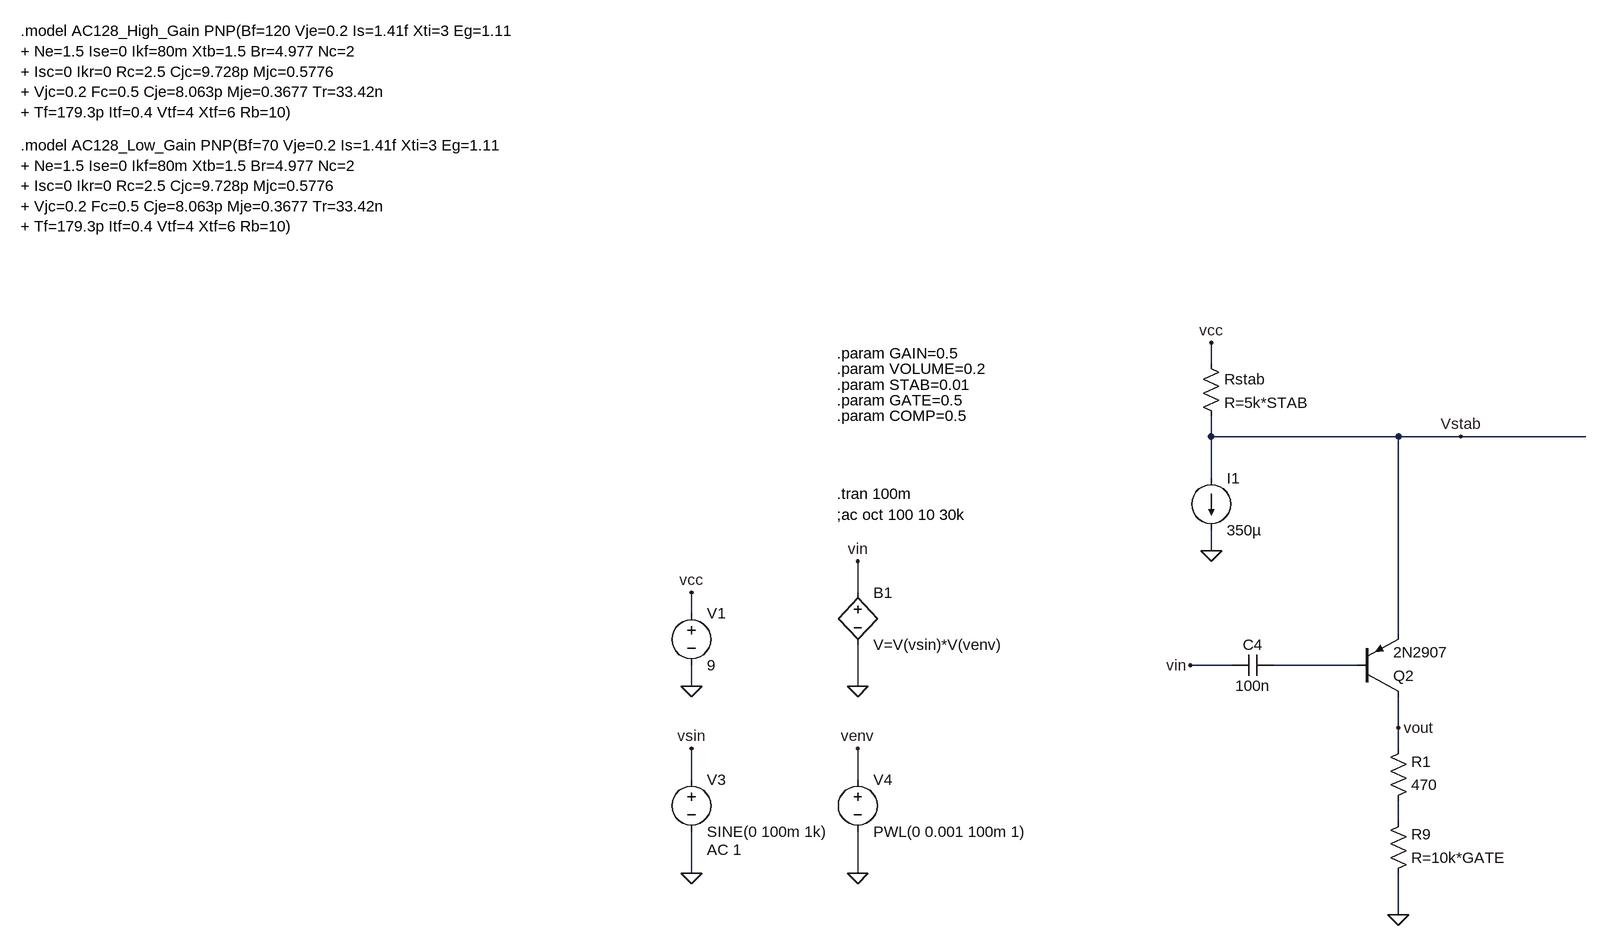
[diagram p0: schematic fuzz_factory_base_04.asc]
fuzz_factory_base_04.asc, the LTspice schematic file:
Version 4
SHEET 1 1968 1668
WIRE 32 -272 32 -304
WIRE 32 -160 32 -192
WIRE 320 -160 32 -160
WIRE 416 -160 320 -160
WIRE 608 -160 416 -160
WIRE 32 -96 32 -160
WIRE 32 16 32 -16
WIRE -512 80 -512 32
WIRE -768 112 -768 80
WIRE 320 144 320 -160
WIRE 64 192 0 192
WIRE 256 192 128 192
WIRE -768 224 -768 192
WIRE -512 224 -512 160
WIRE 320 288 320 240
WIRE 320 320 320 288
WIRE -768 368 -768 320
WIRE -512 368 -512 320
WIRE 320 432 320 400
WIRE -768 512 -768 448
WIRE -512 512 -512 448
WIRE 320 576 320 512
FLAG -768 80 vcc
FLAG -768 224 0
FLAG -512 224 0
FLAG -768 512 0
FLAG -512 512 0
FLAG -768 320 vsin
FLAG -512 320 venv
FLAG 32 -304 vcc
FLAG 320 576 0
FLAG -512 32 vin
FLAG 416 -160 Vstab
FLAG 0 192 vin
FLAG 320 288 vout
FLAG 32 16 0
SYMBOL voltage -768 96 R0
WINDOW 123 0 0 Left 2
WINDOW 39 0 0 Left 2
SYMATTR InstName V1
SYMATTR Value 9
SYMBOL voltage -768 352 R0
WINDOW 123 24 124 Left 2
WINDOW 39 0 0 Left 2
SYMATTR Value2 AC 1
SYMATTR InstName V3
SYMATTR Value SINE(0 100m 1k)
SYMBOL voltage -512 352 R0
WINDOW 123 0 0 Left 2
WINDOW 39 0 0 Left 2
SYMATTR InstName V4
SYMATTR Value PWL(0 0.001 100m 1)
SYMBOL bv -512 64 R0
SYMATTR InstName B1
SYMATTR Value V=V(vsin)*V(venv)
SYMBOL pnp 256 240 M180
SYMATTR InstName Q2
SYMATTR Value 2N2907
SYMBOL res 304 416 M180
WINDOW 0 36 76 Left 2
WINDOW 3 36 40 Left 2
SYMATTR InstName R1
SYMATTR Value 470
SYMBOL cap 128 176 R90
WINDOW 0 0 32 VBottom 2
WINDOW 3 32 32 VTop 2
SYMATTR InstName C4
SYMATTR Value 100n
SYMBOL res 304 528 M180
WINDOW 0 36 76 Left 2
WINDOW 3 36 40 Left 2
SYMATTR InstName R9
SYMATTR Value R=10k*GATE
SYMBOL res 16 -288 R0
SYMATTR InstName Rstab
SYMATTR Value R=5k*STAB
SYMBOL current 32 -96 R0
WINDOW 123 0 0 Left 0
WINDOW 39 0 0 Left 0
SYMATTR InstName I1
SYMATTR Value 350µ
TEXT -544 -288 Left 2 !.param GAIN=0.5
TEXT -544 -264 Left 2 !.param VOLUME=0.2
TEXT -544 -240 Left 2 !.param STAB=0.01
TEXT -544 -72 Left 2 !.tran 100m
TEXT -544 -40 Left 2 !;ac oct 100 10 30k
TEXT -1800 -608 Left 2 !.model AC128_Low_Gain PNP(Bf=70 Vje=0.2 Is=1.41f Xti=3 Eg=1.11\n+ Ne=1.5 Ise=0 Ikf=80m Xtb=1.5 Br=4.977 Nc=2\n+ Isc=0 Ikr=0 Rc=2.5 Cjc=9.728p Mjc=0.5776\n+ Vjc=0.2 Fc=0.5 Cje=8.063p Mje=0.3677 Tr=33.42n\n+ Tf=179.3p Itf=0.4 Vtf=4 Xtf=6 Rb=10)
TEXT -1800 -784 Left 2 !.model AC128_High_Gain PNP(Bf=120 Vje=0.2 Is=1.41f Xti=3 Eg=1.11\n+ Ne=1.5 Ise=0 Ikf=80m Xtb=1.5 Br=4.977 Nc=2\n+ Isc=0 Ikr=0 Rc=2.5 Cjc=9.728p Mjc=0.5776\n+ Vjc=0.2 Fc=0.5 Cje=8.063p Mje=0.3677 Tr=33.42n\n+ Tf=179.3p Itf=0.4 Vtf=4 Xtf=6 Rb=10)
TEXT -544 -216 Left 2 !.param GATE=0.5
TEXT -544 -192 Left 2 !.param COMP=0.5

The netlist it stands for:
* fuzz_factory_base_04.asc
V1 vcc 0 9
V3 vsin 0 SINE(0 100m 1k) AC 1
V4 venv 0 PWL(0 0.001 100m 1)
B1 vin 0 V=V(vsin)*V(venv)
Q2 vout N001 Vstab 0 2N2907
R1 N002 vout 470
C4 N001 vin 100n
R9 0 N002 R=10k*GATE
Rstab vcc Vstab R=5k*STAB
I1 Vstab 0 350µ
.model NPN NPN
.model PNP PNP
.lib standard.bjt
.param GAIN=0.5
.param VOLUME=0.2
.param STAB=0.01
.tran 100m
;ac oct 100 10 30k
.model AC128_Low_Gain PNP(Bf=70 Vje=0.2 Is=1.41f Xti=3 Eg=1.11
+ Ne=1.5 Ise=0 Ikf=80m Xtb=1.5 Br=4.977 Nc=2
+ Isc=0 Ikr=0 Rc=2.5 Cjc=9.728p Mjc=0.5776
+ Vjc=0.2 Fc=0.5 Cje=8.063p Mje=0.3677 Tr=33.42n
+ Tf=179.3p Itf=0.4 Vtf=4 Xtf=6 Rb=10)
.model AC128_High_Gain PNP(Bf=120 Vje=0.2 Is=1.41f Xti=3 Eg=1.11
+ Ne=1.5 Ise=0 Ikf=80m Xtb=1.5 Br=4.977 Nc=2
+ Isc=0 Ikr=0 Rc=2.5 Cjc=9.728p Mjc=0.5776
+ Vjc=0.2 Fc=0.5 Cje=8.063p Mje=0.3677 Tr=33.42n
+ Tf=179.3p Itf=0.4 Vtf=4 Xtf=6 Rb=10)
.param GATE=0.5
.param COMP=0.5
.backanno
.end